# Altium schematic sheet ISO7741.SchDoc
size A
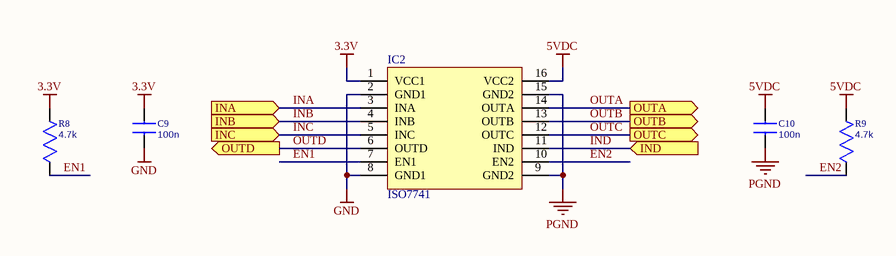
[diagram p0: ISO7741.SchDoc]

## Parts
C9  100n  [C_0603]
C10  100n  [C_0603]
IC2  ISO7741  [SOIC-16]
R8  4.7k  [R_0603]
R9  4.7k  [R_0603]

## Ports
INA (in), INB (in), INC (in), IND (in), OUTA (out), OUTB (out), OUTC (out), OUTD (out)

## Nets
3.3V: C9.2 IC2.1(VCC1) R8.2
5VDC: C10.2 IC2.16(VCC2) R9.2
GND: C9.1 IC2.2(GND1) IC2.8(GND1)
PGND: C10.1 IC2.9(GND2) IC2.15(GND2)
EN1: IC2.7(EN1) R8.1
EN2: IC2.10(EN2) R9.1
INA: IC2.3(INA) ; port INA
INB: IC2.4(INB) ; port INB
INC: IC2.5(INC) ; port INC
IND: IC2.11(IND) ; port IND
OUTA: IC2.14(OUTA) ; port OUTA
OUTB: IC2.13(OUTB) ; port OUTB
OUTC: IC2.12(OUTC) ; port OUTC
OUTD: IC2.6(OUTD) ; port OUTD

## Library data of the parts
C9 C10 = C0603: Capacitor; Value: 100n
IC2 = ISO7741: Quad-Channel Digital Isolators
R8 R9 = R0603: Resistor; Value: 4.7k